# Altium schematic sheet Connectors.SchDoc
size A; SheetNumber: 2; SheetTotal: 4
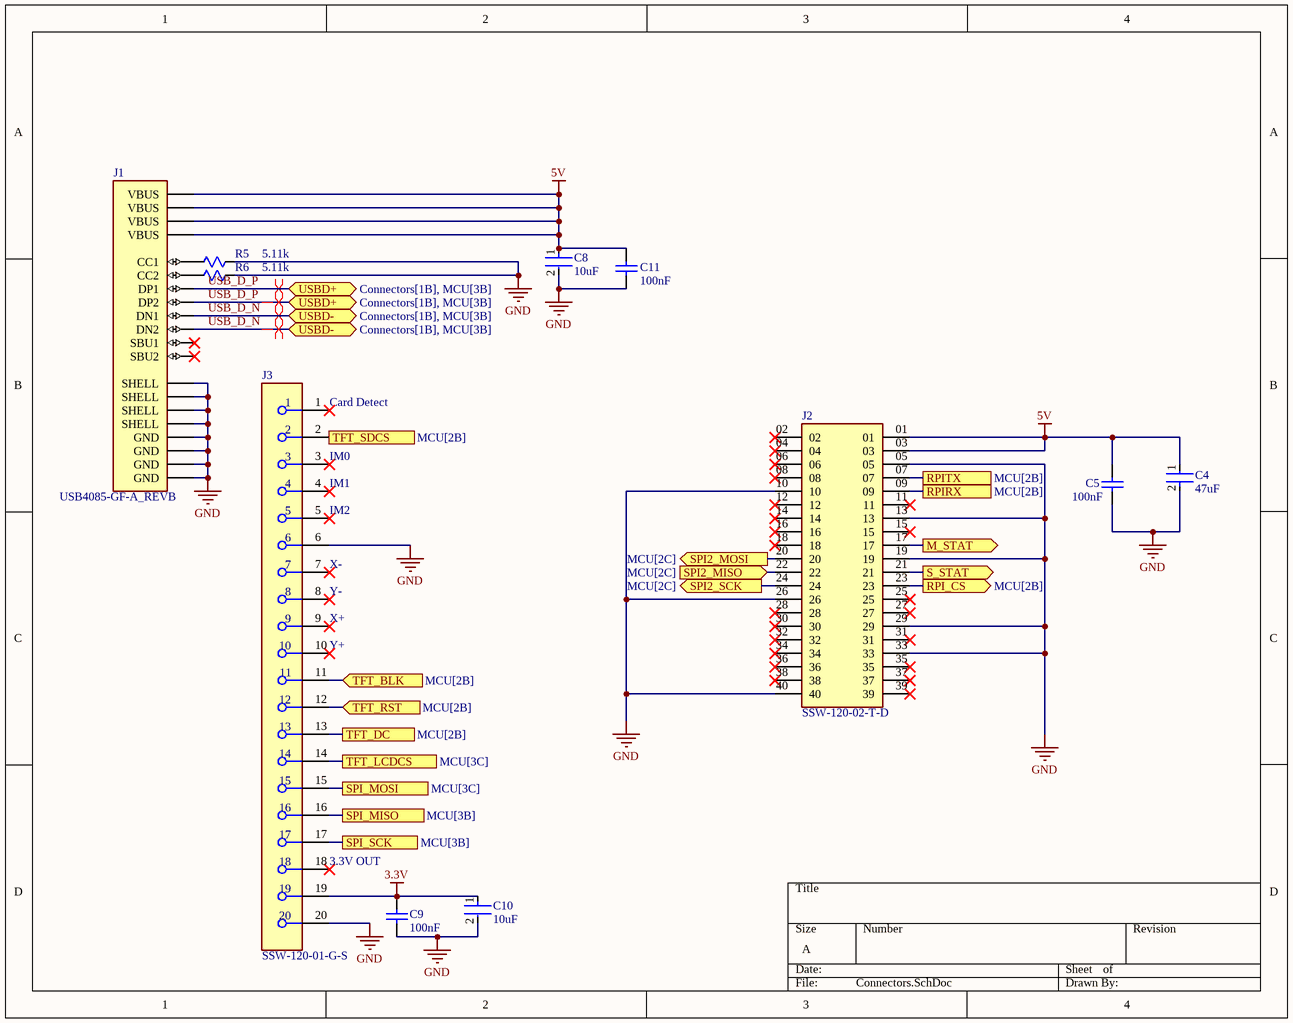
[diagram p0: Connectors.SchDoc]

## Parts
C4  47uF  [FP-GRM31C-0_3-e0_3_0_8-IPC_C]
C5  100nF  [CAPC1608X90X35LL10T15]
C8  10uF  [FP-GRM21B-0_1-IPC_C]
C9  100nF  [CAPC1608X90X35LL10T15]
C10  10uF  [FP-GRM21B-0_1-IPC_C]
C11  100nF  [CAPC1608X90X35LL10T15]
J1  USB4085-GF-A_REVB  [GCT_USB4085-GF-A_REVB]
J2  SSW-120-02-T-D  [SAMTEC_SSW-120-02-T-D]
J3  SSW-120-01-G-S  [FP-SSW-120-01-G-S-MFG]
R5  5.11k  [RESC1608X06N]
R6  5.11k  [RESC1608X06N]

## Ports
M_STAT (out), RPI_CS (out, see MCU[2B]), RPIRX (see MCU[2B]), RPITX (see MCU[2B]), S_STAT (out), SPI2_MISO (in, see MCU[2C]), SPI2_MOSI (out, see MCU[2C]), SPI2_SCK (out, see MCU[2C]), SPI_MISO (see MCU[3B]), SPI_MOSI (see MCU[3C]), SPI_SCK (see MCU[3B]), TFT_BLK (in, see MCU[2B]), TFT_DC (see MCU[2B]), TFT_LCDCS (see MCU[3C]), TFT_RST (in, see MCU[2B]), TFT_SDCS (see MCU[2B]), USBD+ (bidir, see Connectors[1B], MCU[3B]), USBD- (bidir, see Connectors[1B], MCU[3B])

## Nets
3.3V: C9.2 C10.1 J3.19
5V: C4.1 C5.2 C8.1 C11.2 J1.A4(VBUS) J1.A9(VBUS) J1.B4(VBUS) J1.B9(VBUS) J2.01 J2.03
GND: C4.2 C5.1 C8.2 C9.1 C10.2 C11.1 J1.A1(GND) J1.A12(GND) J1.B1(GND) J1.B12(GND) J1.S1(SHELL) J1.S2(SHELL) J1.S3(SHELL) J1.S4(SHELL) J2.05 J2.10 J2.13 J2.19 J2.26 J2.29 J2.33 J2.40 J3.6 J3.20 R5.2 R6.2
M_STAT: J2.17 ; port M_STAT
RPI_CS: J2.23 ; port RPI_CS
RPIRX: J2.09 ; port RPIRX
RPITX: J2.07 ; port RPITX
S_STAT: J2.21 ; port S_STAT
SPI2_MISO: J2.22 ; port SPI2_MISO
SPI2_MOSI: J2.20 ; port SPI2_MOSI
SPI2_SCK: J2.24 ; port SPI2_SCK
SPI_MISO: J3.16 ; port SPI_MISO
SPI_MOSI: J3.15 ; port SPI_MOSI
SPI_SCK: J3.17 ; port SPI_SCK
TFT_BLK: J3.11 ; port TFT_BLK
TFT_DC: J3.13 ; port TFT_DC
TFT_LCDCS: J3.14 ; port TFT_LCDCS
TFT_RST: J3.12 ; port TFT_RST
TFT_SDCS: J3.2 ; port TFT_SDCS
USB_D_N: J1.A7(DN1) J1.B7(DN2) ; port USBD-
USB_D_P: J1.A6(DP1) J1.B6(DP2) ; port USBD+
NetJ1_A5: J1.A5(CC1) R5.1
NetJ1_B5: J1.B5(CC2) R6.1

Not connected (* = marked no-connect by the designer): J1 A8(SBU1)* B8(SBU2)*; J2 02* 04* 06* 08* 11* 12* 14* 15* 16* 18* 25* 27* 28* 30* 31* 32* 34* 35* 36* 37* 38* 39*; J3 1* 3* 4* 5* 7* 8* 9* 10* 18*

## Layout directives
differential pair: USB_D_N, USB_D_P

## Notes on the sheet
- (near J3) Card Detect
- (near J3) IM0
- (near J3) IM1
- (near J3) IM2
- (near J3) X-
- (near J3) Y-
- (near J3) X+
- (near J3) Y+
- (near J3) 3.3V OUT

## Library data of the parts
C4 = CMP-06035-011430-1: Chip Multilayer Ceramic Capacitors for General Purpose, 1206, 47uF, X5R, 15%, 20%, 16V; Capacitance: 47uF; Length: 3.2mm; Thickness: 1.6mm; Width: 1.6mm; Voltage Rating (DC): 16V; Tolerance: 20%; Dielectric: X5R
C5 C9 C11 = CMP-2006-02868-1: Part Number: GRM188R71E104KA01D; Manufacturer: Murata
C8 C10 = CMP-2007-03453-2: Chip Multilayer Ceramic Capacitors for General Purpose, 0805, 10uF, X5R, 15%, 10%, 16V; Radiation Hardening: No; Thickness: 0.053inch; Voltage Rating (DC): 16V; Lead Free: Lead Free; Package Quantity: 1; Width: 1.25mm; Case Code (Imperial): 0805; Depth: 1.25mm; Packaging: Tape and Reel; Dielectric: X5R; Max Operating Temperature: 85°C; Tolerance: 10%; Voltage Rating: 16V; Voltage: 16V; Capacitance: 10uF; Height: 1.25mm; Case Code (Metric): 2012; Material: Ceramic; Mount: Surface Mount; Case/Package: 0805; REACH SVHC: No SVHC; Length: 2mm; Min Operating Temperature: -55°C; Termination: SMD/SMT
J1 = USB4085-GF-A_REVB: USB-C (USB TYPE-C) USB 2.0 æ’åº§è¿žæŽ¥å™¨ 24 (16+8 Dummy) ä½é€šå­”ã€ç›´è§’ã€ä½Žæˆæœ¬ã€3.46mm å¤–å½¢ã€16 é’ˆã€æ°´å¹³ã€é¡¶éƒ¨å®‰è£…; MF: Global Connector Technology; SnapEDA_Link: https://www.snapeda.com/parts/USB4085-GF-A/Global+Connector+Technology/view-part/?ref=snap; Package: None; Value: *; MP: USB4085-GF-A; Check_prices: https://www.snapeda.com/parts/USB4085-GF-A/Global+Connector+Technology/view-part/?ref=eda
J2 = SSW-120-02-T-D: 40 Position Receptacle Connector 0.100 (2.54mm) Through Hole Tin; MF: Samtec Inc.; SnapEDA_Link: https://www.snapeda.com/parts/SSW-120-02-T-D/Samtec+Inc./view-part/?ref=snap; Package: None; Value: *; MP: SSW-120-02-T-D; Check_prices: https://www.snapeda.com/parts/SSW-120-02-T-D/Samtec+Inc./view-part/?ref=eda
J3 = CMP-00575-00296075-1: SSW-120-01-G-S SSW - Samtec 2.54mm Single Row Straight Socket Strip 8.5 Profile (mcv)(TO22); NexarPartId: 296075; Manufacturer Lifecycle Status: PRODUCTION; Number of Contacts: 20; Gender: Receptacle; Connector Type: Receptacle, Socket; Contact Resistance: 10mΩ; Voltage Rating: 550V; Voltage Rating (DC): 655V; Voltage Rating (AC): 465V; Current Rating: 6.9A; Lead Length: 2.64mm; Housing Material: Polymer; Lead Free: Lead Free; Depth: 2.41mm; Termination: Solder; Radiation Hardening: No; Contact Material: Bronze; Lead Pitch: 2.54mm; Number of Rows: 1; Orientation: Straight; Housing Color: Black; Max Voltage Rating (AC): 550V; RoHS: Compliant; Pitch: 2.54mm; Lifecycle Status: Production; Mount: Through Hole; Color: Black; REACH SVHC: No SVHC; Min Operating Temperature: -55°C; Contact Plating: Gold; Length: 51.31mm; Max Operating Temperature: 125°C; Max Current Rating: 6.9A; Number of Positions: 20
R5 R6 = CMP-007-000358-1: RES 5.11K OHM 1% 1/10W 0603; Manufacturer Part Number 1: RC0603FR-075K11L; Manufacturer 1: Yageo; Part Number: RES-0603-5K11-001; Tolerance: 0.01%; Manufacturer 2: Stackpole Electronics; Manufacturer Part Number 3: CRCW06035K11FKED; Manufacturer 3: Vishay Dale; Value: 5.11K; Symbol Path: Symbols/Resistor_Generic.SchLib; Manufacturer Part Number 2: RMCF0603FT5K11